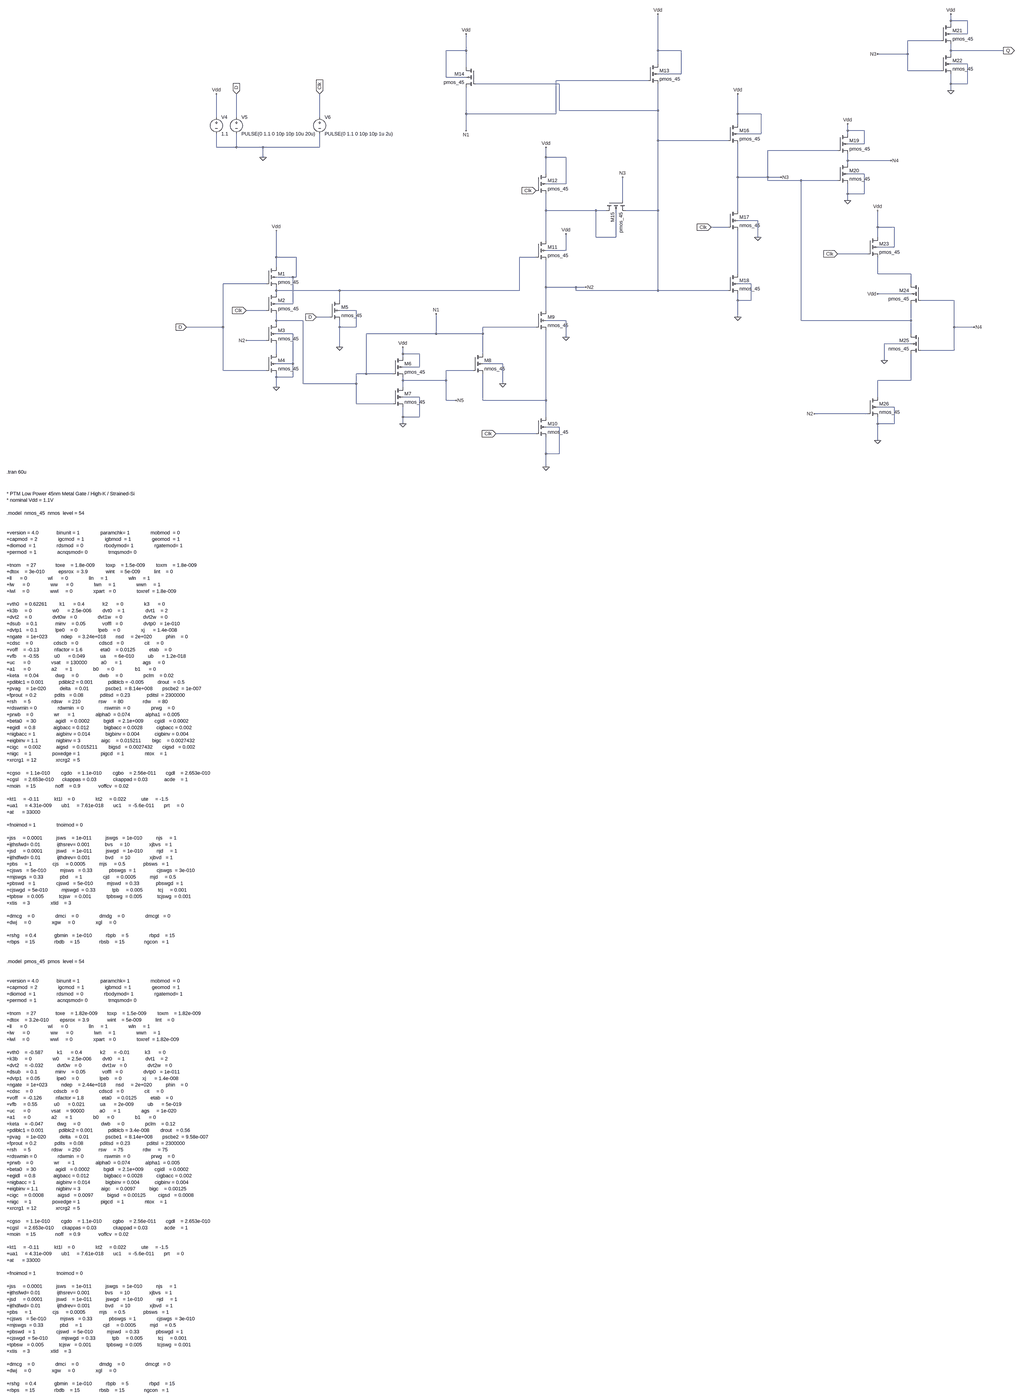
[diagram p0: schematic FinalProj-VLSI.asc, whole sheet]
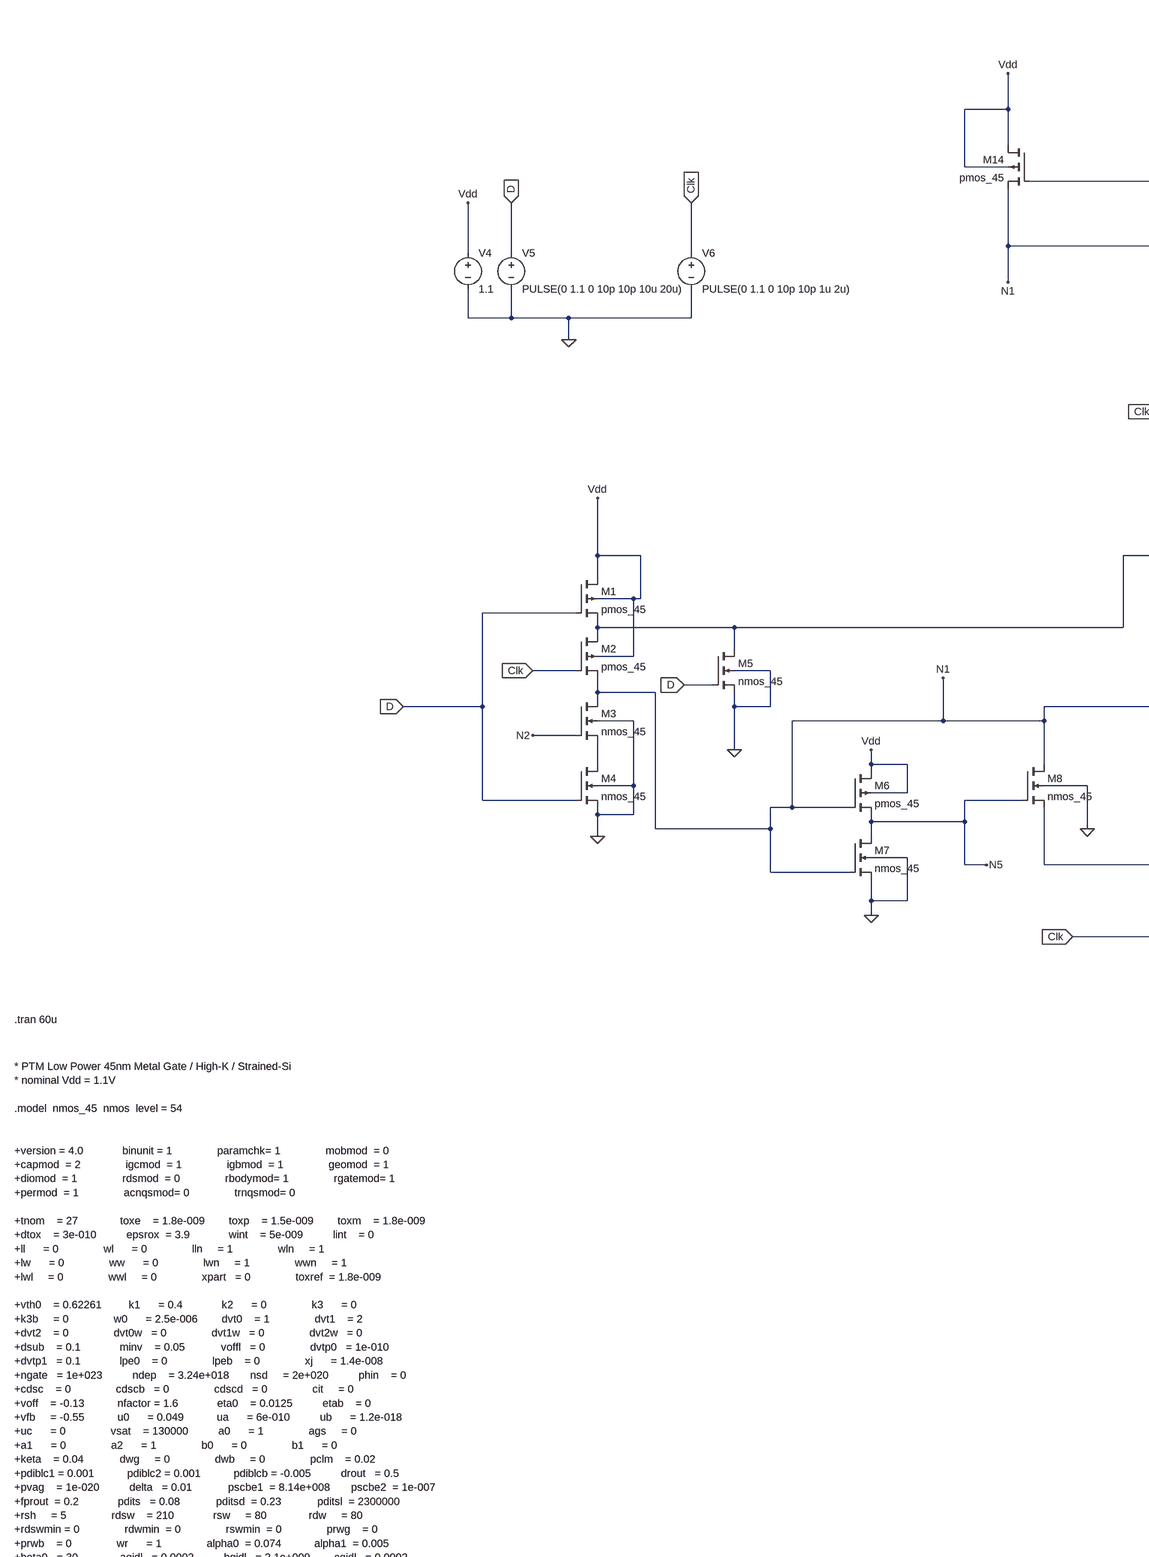
[diagram p1: schematic FinalProj-VLSI.asc, part, row 1 of 2, column 1 of 2]
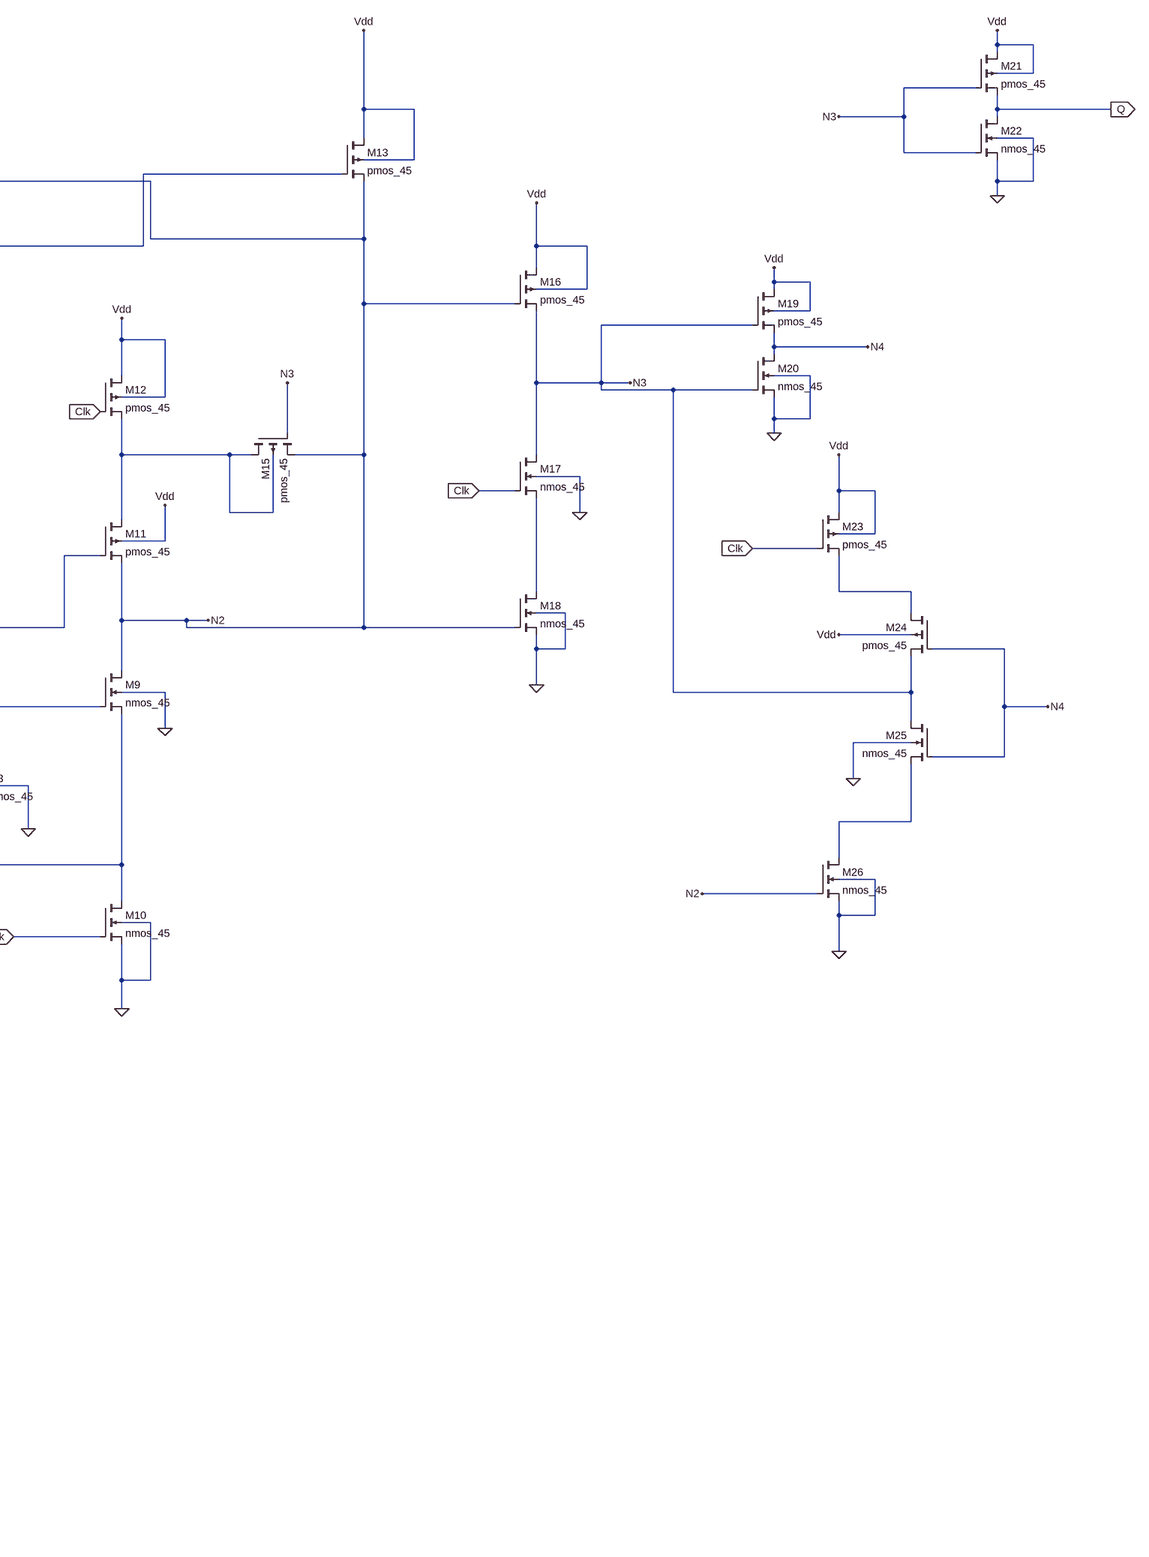
[diagram p2: schematic FinalProj-VLSI.asc, part, row 1 of 2, column 2 of 2]
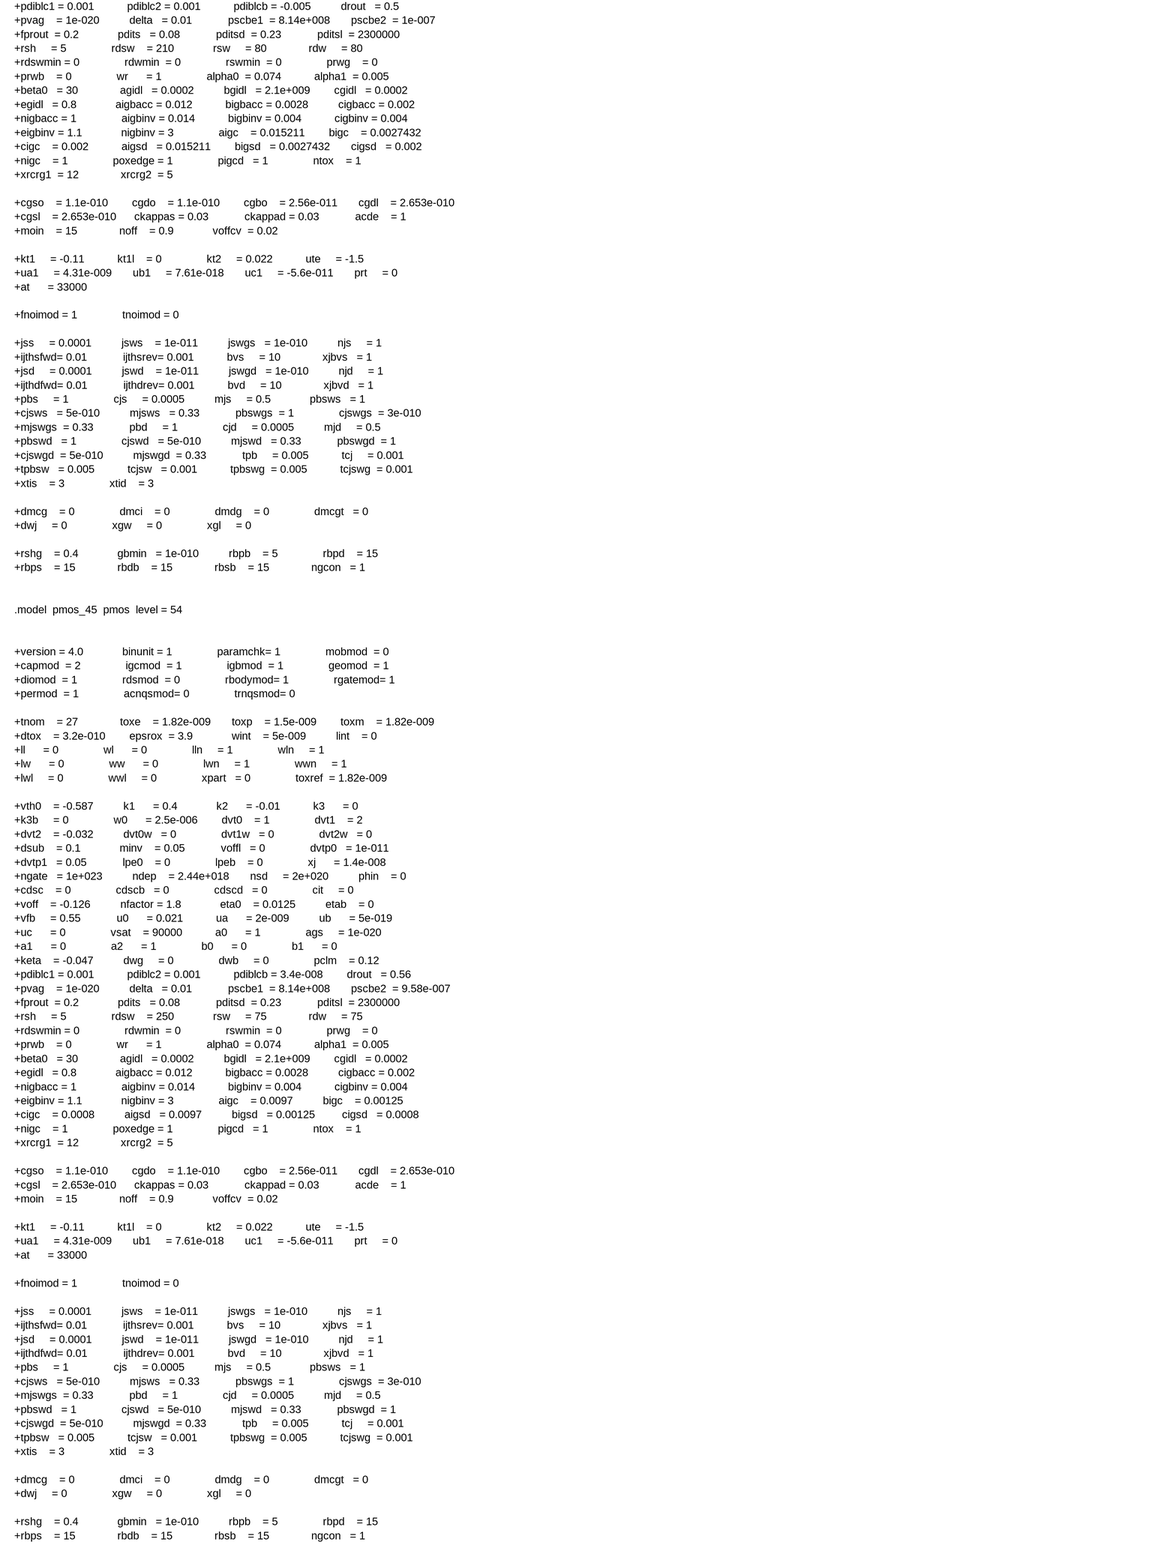
[diagram p3: schematic FinalProj-VLSI.asc, part, row 2 of 2, column 1 of 2]
FinalProj-VLSI.asc, the LTspice schematic file:
Version 4
SHEET 1 3996 5112
WIRE 3584 -1040 3584 -1072
WIRE 3664 -1040 3584 -1040
WIRE 3584 -1024 3584 -1040
WIRE 3664 -976 3664 -1040
WIRE 3664 -976 3584 -976
WIRE 3536 -944 3376 -944
WIRE 1216 -896 1216 -976
WIRE 1216 -896 1120 -896
WIRE 2176 -896 2176 -1072
WIRE 2288 -896 2176 -896
WIRE 3584 -896 3584 -928
WIRE 3920 -896 3584 -896
WIRE 3376 -880 3376 -944
WIRE 3376 -880 3232 -880
WIRE 3584 -880 3584 -896
WIRE 2176 -832 2176 -896
WIRE 3664 -832 3584 -832
WIRE 1216 -816 1216 -896
WIRE 3376 -800 3376 -880
WIRE 3536 -800 3376 -800
WIRE 2288 -784 2288 -896
WIRE 2288 -784 2176 -784
WIRE 1120 -768 1120 -896
WIRE 1216 -768 1120 -768
WIRE 2128 -752 1648 -752
WIRE 1664 -736 1264 -736
WIRE 3584 -736 3584 -784
WIRE 3664 -736 3664 -832
WIRE 3664 -736 3584 -736
WIRE 3584 -704 3584 -736
WIRE 1664 -608 1664 -736
WIRE 2176 -608 2176 -736
WIRE 2176 -608 1664 -608
WIRE 1216 -592 1216 -720
WIRE 1648 -592 1648 -752
WIRE 1648 -592 1216 -592
WIRE 2560 -592 2560 -688
WIRE 2672 -592 2560 -592
WIRE 16 -576 16 -688
WIRE 112 -576 112 -688
WIRE 512 -576 512 -688
WIRE 2560 -544 2560 -592
WIRE 1216 -512 1216 -592
WIRE 3088 -512 3088 -544
WIRE 3168 -512 3088 -512
WIRE 2672 -496 2672 -592
WIRE 2672 -496 2560 -496
WIRE 3088 -496 3088 -512
WIRE 2176 -464 2176 -608
WIRE 2512 -464 2176 -464
WIRE 3168 -448 3168 -512
WIRE 3168 -448 3088 -448
WIRE 16 -432 16 -496
WIRE 112 -432 112 -496
WIRE 112 -432 16 -432
WIRE 240 -432 112 -432
WIRE 512 -432 512 -496
WIRE 512 -432 240 -432
WIRE 3040 -416 2704 -416
WIRE 240 -384 240 -432
WIRE 1600 -384 1600 -432
WIRE 1696 -384 1600 -384
WIRE 3088 -368 3088 -400
WIRE 3296 -368 3088 -368
WIRE 3088 -352 3088 -368
WIRE 1600 -304 1600 -384
WIRE 3168 -304 3088 -304
WIRE 2560 -288 2560 -448
WIRE 2704 -288 2704 -416
WIRE 2704 -288 2560 -288
WIRE 2768 -288 2704 -288
WIRE 2704 -272 2704 -288
WIRE 2864 -272 2704 -272
WIRE 3040 -272 2864 -272
WIRE 1696 -256 1696 -384
WIRE 1696 -256 1600 -256
WIRE 3088 -208 3088 -256
WIRE 3168 -208 3168 -304
WIRE 3168 -208 3088 -208
WIRE 1968 -176 1968 -288
WIRE 3088 -176 3088 -208
WIRE 1600 -128 1600 -208
WIRE 1840 -128 1600 -128
WIRE 1888 -128 1840 -128
WIRE 2176 -128 2176 -464
WIRE 2176 -128 1984 -128
WIRE 2560 -128 2560 -288
WIRE 2656 -80 2560 -80
WIRE 2512 -48 2432 -48
WIRE 3232 -48 3232 -128
WIRE 3312 -48 3232 -48
WIRE 1840 0 1840 -128
WIRE 1936 0 1936 -128
WIRE 1936 0 1840 0
WIRE 2656 0 2656 -80
WIRE 3232 0 3232 -48
WIRE 1600 16 1600 -128
WIRE 3312 48 3312 -48
WIRE 3312 48 3232 48
WIRE 1696 64 1696 -16
WIRE 1696 64 1600 64
WIRE 3184 80 3040 80
WIRE 304 96 304 -32
WIRE 400 96 304 96
WIRE 1552 96 1472 96
WIRE 304 144 304 96
WIRE 2560 176 2560 -32
WIRE 3232 176 3232 96
WIRE 3392 176 3232 176
WIRE 384 192 304 192
WIRE 400 192 400 96
WIRE 400 192 384 192
WIRE 256 224 48 224
WIRE 2624 224 2560 224
WIRE 3392 224 3392 176
WIRE 1600 240 1600 112
WIRE 1744 240 1600 240
WIRE 1792 240 1744 240
WIRE 304 256 304 240
WIRE 608 256 304 256
WIRE 1472 256 1472 96
WIRE 1472 256 608 256
WIRE 1744 256 1744 240
WIRE 2176 256 2176 -128
WIRE 2176 256 1744 256
WIRE 2512 256 2176 256
WIRE 304 272 304 256
WIRE 3392 272 3232 272
WIRE 608 304 608 256
WIRE 2560 304 2560 272
WIRE 2624 304 2624 224
WIRE 2624 304 2560 304
WIRE 3600 304 3440 304
WIRE 384 320 384 192
WIRE 384 320 304 320
WIRE 256 352 160 352
WIRE 688 352 608 352
WIRE 1600 352 1600 240
WIRE 560 384 496 384
WIRE 2560 384 2560 304
WIRE 304 400 304 368
WIRE 432 400 304 400
WIRE 1696 400 1600 400
WIRE 2864 400 2864 -272
WIRE 3392 400 3392 320
WIRE 3392 400 2864 400
WIRE 304 416 304 400
WIRE 48 432 48 224
WIRE 48 432 -128 432
WIRE 608 432 608 400
WIRE 688 432 688 352
WIRE 688 432 608 432
WIRE 1552 432 1296 432
WIRE 3600 432 3600 304
WIRE 3696 432 3600 432
WIRE 384 464 304 464
WIRE 1072 464 1072 368
WIRE 1072 464 736 464
WIRE 1296 464 1296 432
WIRE 1296 464 1072 464
WIRE 3392 464 3392 400
WIRE 1696 480 1696 400
WIRE 256 496 160 496
WIRE 3392 512 3264 512
WIRE 608 528 608 432
WIRE 3600 544 3600 432
WIRE 3600 544 3440 544
WIRE 304 560 304 512
WIRE 912 560 912 528
WIRE 992 560 912 560
WIRE 1296 560 1296 464
WIRE 912 576 912 560
WIRE 3264 592 3264 512
WIRE 384 608 384 464
WIRE 384 608 304 608
WIRE 1392 608 1296 608
WIRE 992 624 992 560
WIRE 992 624 912 624
WIRE 48 640 48 432
WIRE 256 640 48 640
WIRE 1248 640 1120 640
WIRE 736 656 736 464
WIRE 736 656 688 656
WIRE 864 656 736 656
WIRE 304 672 304 656
WIRE 384 672 384 608
WIRE 384 672 304 672
WIRE 912 688 912 672
WIRE 1120 688 1120 640
WIRE 1120 688 912 688
WIRE 3392 688 3392 560
WIRE 3392 688 3232 688
WIRE 432 704 432 400
WIRE 688 704 688 656
WIRE 688 704 432 704
WIRE 1392 704 1392 608
WIRE 304 720 304 672
WIRE 912 720 912 688
WIRE 992 768 912 768
WIRE 3232 768 3232 688
WIRE 1120 784 1120 688
WIRE 1168 784 1120 784
WIRE 1296 784 1296 656
WIRE 1600 784 1600 448
WIRE 1600 784 1296 784
WIRE 688 800 688 704
WIRE 864 800 688 800
WIRE 3312 816 3232 816
WIRE 3184 848 2928 848
WIRE 912 864 912 816
WIRE 992 864 992 768
WIRE 992 864 912 864
WIRE 1600 864 1600 784
WIRE 912 896 912 864
WIRE 3232 896 3232 864
WIRE 3312 896 3312 816
WIRE 3312 896 3232 896
WIRE 1664 912 1600 912
WIRE 1552 944 1360 944
WIRE 3232 976 3232 896
WIRE 1600 1040 1600 960
WIRE 1664 1040 1664 912
WIRE 1664 1040 1600 1040
WIRE 1600 1104 1600 1040
FLAG -128 432 D
IOPIN -128 432 In
FLAG 496 384 D
IOPIN 496 384 In
FLAG 304 -32 Vdd
FLAG 304 720 0
FLAG 608 528 0
FLAG 160 352 Clk
IOPIN 160 352 In
FLAG 912 528 Vdd
FLAG 912 896 0
FLAG 1392 704 0
FLAG 1696 480 0
FLAG 1600 1104 0
FLAG 1360 944 Clk
IOPIN 1360 944 In
FLAG 1552 -224 Clk
IOPIN 1552 -224 In
FLAG 1600 -432 Vdd
FLAG 1072 368 N1
FLAG 1168 784 N5
FLAG 1216 -512 N1
FLAG 1216 -976 Vdd
FLAG 2176 -1072 Vdd
FLAG 1696 -16 Vdd
FLAG 160 496 N2
FLAG 1968 -288 N3
FLAG 1792 240 N2
FLAG 2560 -688 Vdd
FLAG 2656 0 0
FLAG 2560 384 0
FLAG 2432 -48 Clk
IOPIN 2432 -48 In
FLAG 2768 -288 N3
FLAG 3088 -544 Vdd
FLAG 3088 -176 0
FLAG 3584 -1072 Vdd
FLAG 3584 -704 0
FLAG 3232 -880 N3
FLAG 3296 -368 N4
FLAG 3696 432 N4
FLAG 3040 80 Clk
IOPIN 3040 80 In
FLAG 3232 272 Vdd
FLAG 3232 -128 Vdd
FLAG 3264 592 0
FLAG 3232 976 0
FLAG 2928 848 N2
FLAG 3920 -896 Q
IOPIN 3920 -896 Out
FLAG 112 -688 D
IOPIN 112 -688 In
FLAG 512 -688 Clk
IOPIN 512 -688 In
FLAG 16 -688 Vdd
FLAG 240 -384 0
SYMBOL pmos4 256 144 R0
SYMATTR InstName M1
SYMATTR Value pmos_45
SYMATTR Value2 l=45n w=180n
SYMBOL pmos4 256 272 R0
SYMATTR InstName M2
SYMATTR Value pmos_45
SYMATTR Value2 l=45n w=180n
SYMBOL nmos4 256 416 R0
SYMATTR InstName M3
SYMATTR Value nmos_45
SYMATTR Value2 l=45n w=90n
SYMBOL nmos4 256 560 R0
SYMATTR InstName M4
SYMATTR Value nmos_45
SYMATTR Value2 l=45n w=90n
SYMBOL nmos4 560 304 R0
SYMATTR InstName M5
SYMATTR Value nmos_45
SYMATTR Value2 l=45n w=90n
SYMBOL pmos4 864 576 R0
SYMATTR InstName M6
SYMATTR Value pmos_45
SYMATTR Value2 l=45n w=180n
SYMBOL nmos4 864 720 R0
SYMATTR InstName M7
SYMATTR Value nmos_45
SYMATTR Value2 l=45n w=90n
SYMBOL nmos4 1248 560 R0
SYMATTR InstName M8
SYMATTR Value nmos_45
SYMATTR Value2 l=45n w=90n
SYMBOL nmos4 1552 352 R0
SYMATTR InstName M9
SYMATTR Value nmos_45
SYMATTR Value2 l=45n w=90n
SYMBOL nmos4 1552 864 R0
SYMATTR InstName M10
SYMATTR Value nmos_45
SYMATTR Value2 l=45n w=90n
SYMBOL pmos4 1552 16 R0
SYMATTR InstName M11
SYMATTR Value pmos_45
SYMATTR Value2 l=45n w=180n
SYMBOL pmos4 1552 -304 R0
SYMATTR InstName M12
SYMATTR Value pmos_45
SYMATTR Value2 l=45n w=180n
SYMBOL pmos4 2128 -832 R0
SYMATTR InstName M13
SYMATTR Value pmos_45
SYMATTR Value2 l=45n w=180n
SYMBOL pmos4 1264 -816 M0
SYMATTR InstName M14
SYMATTR Value pmos_45
SYMATTR Value2 l=45n w=180n
SYMBOL pmos4 1888 -176 M90
SYMATTR InstName M15
SYMATTR Value pmos_45
SYMATTR Value2 l=45n w=180n
SYMBOL pmos4 2512 -544 R0
SYMATTR InstName M16
SYMATTR Value pmos_45
SYMATTR Value2 l=45n w=180n
SYMBOL nmos4 2512 -128 R0
SYMATTR InstName M17
SYMATTR Value nmos_45
SYMATTR Value2 l=45n w=90n
SYMBOL nmos4 2512 176 R0
SYMATTR InstName M18
SYMATTR Value nmos_45
SYMATTR Value2 l=45n w=90n
SYMBOL pmos4 3040 -496 R0
SYMATTR InstName M19
SYMATTR Value pmos_45
SYMATTR Value2 l=45n w=180n
SYMBOL nmos4 3040 -352 R0
SYMATTR InstName M20
SYMATTR Value nmos_45
SYMATTR Value2 l=45n w=90n
SYMBOL pmos4 3536 -1024 R0
SYMATTR InstName M21
SYMATTR Value pmos_45
SYMATTR Value2 l=45n w=180n
SYMBOL nmos4 3536 -880 R0
SYMATTR InstName M22
SYMATTR Value nmos_45
SYMATTR Value2 l=45n w=90n
SYMBOL pmos4 3184 0 R0
SYMATTR InstName M23
SYMATTR Value pmos_45
SYMATTR Value2 l=45n w=180n
SYMBOL pmos4 3440 224 M0
SYMATTR InstName M24
SYMATTR Value pmos_45
SYMATTR Value2 l=45n w=180n
SYMBOL nmos4 3440 464 M0
SYMATTR InstName M25
SYMATTR Value nmos_45
SYMATTR Value2 l=45n w=90n
SYMBOL nmos4 3184 768 R0
SYMATTR InstName M26
SYMATTR Value nmos_45
SYMATTR Value2 l=45n w=90n
SYMBOL voltage 16 -592 R0
WINDOW 123 0 0 Left 0
WINDOW 39 0 0 Left 0
SYMATTR InstName V4
SYMATTR Value 1.1
SYMBOL voltage 112 -592 R0
WINDOW 123 0 0 Left 0
WINDOW 39 0 0 Left 0
SYMATTR InstName V5
SYMATTR Value PULSE(0 1.1 0 10p 10p 10u 20u)
SYMBOL voltage 512 -592 R0
WINDOW 123 0 0 Left 0
WINDOW 39 0 0 Left 0
SYMATTR InstName V6
SYMATTR Value PULSE(0 1.1 0 10p 10p 1u 2u)
TEXT -992 1128 Left 2 !.tran 60u
TEXT -992 1232 Left 2 !* PTM Low Power 45nm Metal Gate / High-K / Strained-Si\n* nominal Vdd = 1.1V\n \n.model  nmos_45  nmos  level = 54\n \n \n+version = 4.0             binunit = 1               paramchk= 1               mobmod  = 0             \n+capmod  = 2               igcmod  = 1               igbmod  = 1               geomod  = 1             \n+diomod  = 1               rdsmod  = 0               rbodymod= 1               rgatemod= 1             \n+permod  = 1               acnqsmod= 0               trnqsmod= 0             \n \n+tnom    = 27              toxe    = 1.8e-009        toxp    = 1.5e-009        toxm    = 1.8e-009      \n+dtox    = 3e-010          epsrox  = 3.9             wint    = 5e-009          lint    = 0             \n+ll      = 0               wl      = 0               lln     = 1               wln     = 1             \n+lw      = 0               ww      = 0               lwn     = 1               wwn     = 1             \n+lwl     = 0               wwl     = 0               xpart   = 0               toxref  = 1.8e-009      \n \n+vth0    = 0.62261         k1      = 0.4             k2      = 0               k3      = 0             \n+k3b     = 0               w0      = 2.5e-006        dvt0    = 1               dvt1    = 2             \n+dvt2    = 0               dvt0w   = 0               dvt1w   = 0               dvt2w   = 0             \n+dsub    = 0.1             minv    = 0.05            voffl   = 0               dvtp0   = 1e-010        \n+dvtp1   = 0.1             lpe0    = 0               lpeb    = 0               xj      = 1.4e-008      \n+ngate   = 1e+023          ndep    = 3.24e+018       nsd     = 2e+020          phin    = 0             \n+cdsc    = 0               cdscb   = 0               cdscd   = 0               cit     = 0             \n+voff    = -0.13           nfactor = 1.6             eta0    = 0.0125          etab    = 0             \n+vfb     = -0.55           u0      = 0.049           ua      = 6e-010          ub      = 1.2e-018      \n+uc      = 0               vsat    = 130000          a0      = 1               ags     = 0             \n+a1      = 0               a2      = 1               b0      = 0               b1      = 0             \n+keta    = 0.04            dwg     = 0               dwb     = 0               pclm    = 0.02          \n+pdiblc1 = 0.001           pdiblc2 = 0.001           pdiblcb = -0.005          drout   = 0.5           \n+pvag    = 1e-020          delta   = 0.01            pscbe1  = 8.14e+008       pscbe2  = 1e-007        \n+fprout  = 0.2             pdits   = 0.08            pditsd  = 0.23            pditsl  = 2300000       \n+rsh     = 5               rdsw    = 210             rsw     = 80              rdw     = 80            \n+rdswmin = 0               rdwmin  = 0               rswmin  = 0               prwg    = 0             \n+prwb    = 0               wr      = 1               alpha0  = 0.074           alpha1  = 0.005         \n+beta0   = 30              agidl   = 0.0002          bgidl   = 2.1e+009        cgidl   = 0.0002        \n+egidl   = 0.8             aigbacc = 0.012           bigbacc = 0.0028          cigbacc = 0.002         \n+nigbacc = 1               aigbinv = 0.014           bigbinv = 0.004           cigbinv = 0.004         \n+eigbinv = 1.1             nigbinv = 3               aigc    = 0.015211        bigc    = 0.0027432     \n+cigc    = 0.002           aigsd   = 0.015211        bigsd   = 0.0027432       cigsd   = 0.002         \n+nigc    = 1               poxedge = 1               pigcd   = 1               ntox    = 1             \n+xrcrg1  = 12              xrcrg2  = 5             \n \n+cgso    = 1.1e-010        cgdo    = 1.1e-010        cgbo    = 2.56e-011       cgdl    = 2.653e-010    \n+cgsl    = 2.653e-010      ckappas = 0.03            ckappad = 0.03            acde    = 1             \n+moin    = 15              noff    = 0.9             voffcv  = 0.02          \n \n+kt1     = -0.11           kt1l    = 0               kt2     = 0.022           ute     = -1.5          \n+ua1     = 4.31e-009       ub1     = 7.61e-018       uc1     = -5.6e-011       prt     = 0             \n+at      = 33000         \n \n+fnoimod = 1               tnoimod = 0             \n \n+jss     = 0.0001          jsws    = 1e-011          jswgs   = 1e-010          njs     = 1             \n+ijthsfwd= 0.01            ijthsrev= 0.001           bvs     = 10              xjbvs   = 1             \n+jsd     = 0.0001          jswd    = 1e-011          jswgd   = 1e-010          njd     = 1             \n+ijthdfwd= 0.01            ijthdrev= 0.001           bvd     = 10              xjbvd   = 1             \n+pbs     = 1               cjs     = 0.0005          mjs     = 0.5             pbsws   = 1             \n+cjsws   = 5e-010          mjsws   = 0.33            pbswgs  = 1               cjswgs  = 3e-010        \n+mjswgs  = 0.33            pbd     = 1               cjd     = 0.0005          mjd     = 0.5           \n+pbswd   = 1               cjswd   = 5e-010          mjswd   = 0.33            pbswgd  = 1             \n+cjswgd  = 5e-010          mjswgd  = 0.33            tpb     = 0.005           tcj     = 0.001         \n+tpbsw   = 0.005           tcjsw   = 0.001           tpbswg  = 0.005           tcjswg  = 0.001         \n+xtis    = 3               xtid    = 3             \n \n+dmcg    = 0               dmci    = 0               dmdg    = 0               dmcgt   = 0             \n+dwj     = 0               xgw     = 0               xgl     = 0             \n \n+rshg    = 0.4             gbmin   = 1e-010          rbpb    = 5               rbpd    = 15            \n+rbps    = 15              rbdb    = 15              rbsb    = 15              ngcon   = 1             \n \n \n.model  pmos_45  pmos  level = 54\n \n \n+version = 4.0             binunit = 1               paramchk= 1               mobmod  = 0             \n+capmod  = 2               igcmod  = 1               igbmod  = 1               geomod  = 1             \n+diomod  = 1               rdsmod  = 0               rbodymod= 1               rgatemod= 1             \n+permod  = 1               acnqsmod= 0               trnqsmod= 0             \n \n+tnom    = 27              toxe    = 1.82e-009       toxp    = 1.5e-009        toxm    = 1.82e-009     \n+dtox    = 3.2e-010        epsrox  = 3.9             wint    = 5e-009          lint    = 0             \n+ll      = 0               wl      = 0               lln     = 1               wln     = 1             \n+lw      = 0               ww      = 0               lwn     = 1               wwn     = 1             \n+lwl     = 0               wwl     = 0               xpart   = 0               toxref  = 1.82e-009     \n \n+vth0    = -0.587          k1      = 0.4             k2      = -0.01           k3      = 0             \n+k3b     = 0               w0      = 2.5e-006        dvt0    = 1               dvt1    = 2             \n+dvt2    = -0.032          dvt0w   = 0               dvt1w   = 0               dvt2w   = 0             \n+dsub    = 0.1             minv    = 0.05            voffl   = 0               dvtp0   = 1e-011        \n+dvtp1   = 0.05            lpe0    = 0               lpeb    = 0               xj      = 1.4e-008      \n+ngate   = 1e+023          ndep    = 2.44e+018       nsd     = 2e+020          phin    = 0             \n+cdsc    = 0               cdscb   = 0               cdscd   = 0               cit     = 0             \n+voff    = -0.126          nfactor = 1.8             eta0    = 0.0125          etab    = 0             \n+vfb     = 0.55            u0      = 0.021           ua      = 2e-009          ub      = 5e-019        \n+uc      = 0               vsat    = 90000           a0      = 1               ags     = 1e-020        \n+a1      = 0               a2      = 1               b0      = 0               b1      = 0             \n+keta    = -0.047          dwg     = 0               dwb     = 0               pclm    = 0.12          \n+pdiblc1 = 0.001           pdiblc2 = 0.001           pdiblcb = 3.4e-008        drout   = 0.56          \n+pvag    = 1e-020          delta   = 0.01            pscbe1  = 8.14e+008       pscbe2  = 9.58e-007     \n+fprout  = 0.2             pdits   = 0.08            pditsd  = 0.23            pditsl  = 2300000       \n+rsh     = 5               rdsw    = 250             rsw     = 75              rdw     = 75            \n+rdswmin = 0               rdwmin  = 0               rswmin  = 0               prwg    = 0             \n+prwb    = 0               wr      = 1               alpha0  = 0.074           alpha1  = 0.005         \n+beta0   = 30              agidl   = 0.0002          bgidl   = 2.1e+009        cgidl   = 0.0002        \n+egidl   = 0.8             aigbacc = 0.012           bigbacc = 0.0028          cigbacc = 0.002         \n+nigbacc = 1               aigbinv = 0.014           bigbinv = 0.004           cigbinv = 0.004         \n+eigbinv = 1.1             nigbinv = 3               aigc    = 0.0097          bigc    = 0.00125       \n+cigc    = 0.0008          aigsd   = 0.0097          bigsd   = 0.00125         cigsd   = 0.0008        \n+nigc    = 1               poxedge = 1               pigcd   = 1               ntox    = 1             \n+xrcrg1  = 12              xrcrg2  = 5             \n \n+cgso    = 1.1e-010        cgdo    = 1.1e-010        cgbo    = 2.56e-011       cgdl    = 2.653e-010    \n+cgsl    = 2.653e-010      ckappas = 0.03            ckappad = 0.03            acde    = 1             \n+moin    = 15              noff    = 0.9             voffcv  = 0.02          \n \n+kt1     = -0.11           kt1l    = 0               kt2     = 0.022           ute     = -1.5          \n+ua1     = 4.31e-009       ub1     = 7.61e-018       uc1     = -5.6e-011       prt     = 0             \n+at      = 33000         \n \n+fnoimod = 1               tnoimod = 0             \n \n+jss     = 0.0001          jsws    = 1e-011          jswgs   = 1e-010          njs     = 1             \n+ijthsfwd= 0.01            ijthsrev= 0.001           bvs     = 10              xjbvs   = 1             \n+jsd     = 0.0001          jswd    = 1e-011          jswgd   = 1e-010          njd     = 1             \n+ijthdfwd= 0.01            ijthdrev= 0.001           bvd     = 10              xjbvd   = 1             \n+pbs     = 1               cjs     = 0.0005          mjs     = 0.5             pbsws   = 1             \n+cjsws   = 5e-010          mjsws   = 0.33            pbswgs  = 1               cjswgs  = 3e-010        \n+mjswgs  = 0.33            pbd     = 1               cjd     = 0.0005          mjd     = 0.5           \n+pbswd   = 1               cjswd   = 5e-010          mjswd   = 0.33            pbswgd  = 1             \n+cjswgd  = 5e-010          mjswgd  = 0.33            tpb     = 0.005           tcj     = 0.001         \n+tpbsw   = 0.005           tcjsw   = 0.001           tpbswg  = 0.005           tcjswg  = 0.001         \n+xtis    = 3               xtid    = 3             \n \n+dmcg    = 0               dmci    = 0               dmdg    = 0               dmcgt   = 0             \n+dwj     = 0               xgw     = 0               xgl     = 0             \n \n+rshg    = 0.4             gbmin   = 1e-010          rbpb    = 5               rbpd    = 15            \n+rbps    = 15              rbdb    = 15              rbsb    = 15              ngcon   = 1

The netlist it stands for:
* FinalProj-VLSI.asc
M1 Vdd D N002 Vdd pmos_45 l=45n w=180n
M2 N002 Clk N1 Vdd pmos_45 l=45n w=180n
M3 N1 N2 N005 0 nmos_45 l=45n w=90n
M4 N005 D 0 0 nmos_45 l=45n w=90n
M5 N002 D 0 0 nmos_45 l=45n w=90n
M6 Vdd N1 N5 Vdd pmos_45 l=45n w=180n
M7 N5 N1 0 0 nmos_45 l=45n w=90n
M8 N1 N5 N007 0 nmos_45 l=45n w=90n
M9 N2 N1 N007 0 nmos_45 l=45n w=90n
M10 N007 Clk 0 0 nmos_45 l=45n w=90n
M11 N001 N002 N2 Vdd pmos_45 l=45n w=180n
M12 Vdd Clk N001 Vdd pmos_45 l=45n w=180n
M13 Vdd N1 N2 Vdd pmos_45 l=45n w=180n
M14 Vdd N2 N1 Vdd pmos_45 l=45n w=180n
M15 N001 N3 N2 N001 pmos_45 l=45n w=180n
M16 Vdd N2 N3 Vdd pmos_45 l=45n w=180n
M17 N3 Clk N003 0 nmos_45 l=45n w=90n
M18 N003 N2 0 0 nmos_45 l=45n w=90n
M19 Vdd N3 N4 Vdd pmos_45 l=45n w=180n
M20 N4 N3 0 0 nmos_45 l=45n w=90n
M21 Vdd N3 Q Vdd pmos_45 l=45n w=180n
M22 Q N3 0 0 nmos_45 l=45n w=90n
M23 Vdd Clk N004 Vdd pmos_45 l=45n w=180n
M24 N004 N4 N3 Vdd pmos_45 l=45n w=180n
M25 N3 N4 N006 0 nmos_45 l=45n w=90n
M26 N006 N2 0 0 nmos_45 l=45n w=90n
V4 Vdd 0 1.1
V5 D 0 PULSE(0 1.1 0 10p 10p 10u 20u)
V6 Clk 0 PULSE(0 1.1 0 10p 10p 1u 2u)
.model NMOS NMOS
.model PMOS PMOS
.lib standard.mos
.tran 60u
* PTM Low Power 45nm Metal Gate / High-K / Strained-Si
* nominal Vdd = 1.1V
.model  nmos_45  nmos  level = 54
+version = 4.0             binunit = 1               paramchk= 1               mobmod  = 0
+capmod  = 2               igcmod  = 1               igbmod  = 1               geomod  = 1
+diomod  = 1               rdsmod  = 0               rbodymod= 1               rgatemod= 1
+permod  = 1               acnqsmod= 0               trnqsmod= 0
+tnom    = 27              toxe    = 1.8e-009        toxp    = 1.5e-009        toxm    = 1.8e-009
+dtox    = 3e-010          epsrox  = 3.9             wint    = 5e-009          lint    = 0
+ll      = 0               wl      = 0               lln     = 1               wln     = 1
+lw      = 0               ww      = 0               lwn     = 1               wwn     = 1
+lwl     = 0               wwl     = 0               xpart   = 0               toxref  = 1.8e-009
+vth0    = 0.62261         k1      = 0.4             k2      = 0               k3      = 0
+k3b     = 0               w0      = 2.5e-006        dvt0    = 1               dvt1    = 2
+dvt2    = 0               dvt0w   = 0               dvt1w   = 0               dvt2w   = 0
+dsub    = 0.1             minv    = 0.05            voffl   = 0               dvtp0   = 1e-010
+dvtp1   = 0.1             lpe0    = 0               lpeb    = 0               xj      = 1.4e-008
+ngate   = 1e+023          ndep    = 3.24e+018       nsd     = 2e+020          phin    = 0
+cdsc    = 0               cdscb   = 0               cdscd   = 0               cit     = 0
+voff    = -0.13           nfactor = 1.6             eta0    = 0.0125          etab    = 0
+vfb     = -0.55           u0      = 0.049           ua      = 6e-010          ub      = 1.2e-018
+uc      = 0               vsat    = 130000          a0      = 1               ags     = 0
+a1      = 0               a2      = 1               b0      = 0               b1      = 0
+keta    = 0.04            dwg     = 0               dwb     = 0               pclm    = 0.02
+pdiblc1 = 0.001           pdiblc2 = 0.001           pdiblcb = -0.005          drout   = 0.5
+pvag    = 1e-020          delta   = 0.01            pscbe1  = 8.14e+008       pscbe2  = 1e-007
+fprout  = 0.2             pdits   = 0.08            pditsd  = 0.23            pditsl  = 2300000
+rsh     = 5               rdsw    = 210             rsw     = 80              rdw     = 80
+rdswmin = 0               rdwmin  = 0               rswmin  = 0               prwg    = 0
+prwb    = 0               wr      = 1               alpha0  = 0.074           alpha1  = 0.005
+beta0   = 30              agidl   = 0.0002          bgidl   = 2.1e+009        cgidl   = 0.0002
+egidl   = 0.8             aigbacc = 0.012           bigbacc = 0.0028          cigbacc = 0.002
+nigbacc = 1               aigbinv = 0.014           bigbinv = 0.004           cigbinv = 0.004
+eigbinv = 1.1             nigbinv = 3               aigc    = 0.015211        bigc    = 0.0027432
+cigc    = 0.002           aigsd   = 0.015211        bigsd   = 0.0027432       cigsd   = 0.002
+nigc    = 1               poxedge = 1               pigcd   = 1               ntox    = 1
+xrcrg1  = 12              xrcrg2  = 5
+cgso    = 1.1e-010        cgdo    = 1.1e-010        cgbo    = 2.56e-011       cgdl    = 2.653e-010
+cgsl    = 2.653e-010      ckappas = 0.03            ckappad = 0.03            acde    = 1
+moin    = 15              noff    = 0.9             voffcv  = 0.02
+kt1     = -0.11           kt1l    = 0               kt2     = 0.022           ute     = -1.5
+ua1     = 4.31e-009       ub1     = 7.61e-018       uc1     = -5.6e-011       prt     = 0
+at      = 33000
+fnoimod = 1               tnoimod = 0
+jss     = 0.0001          jsws    = 1e-011          jswgs   = 1e-010          njs     = 1
+ijthsfwd= 0.01            ijthsrev= 0.001           bvs     = 10              xjbvs   = 1
+jsd     = 0.0001          jswd    = 1e-011          jswgd   = 1e-010          njd     = 1
+ijthdfwd= 0.01            ijthdrev= 0.001           bvd     = 10              xjbvd   = 1
+pbs     = 1               cjs     = 0.0005          mjs     = 0.5             pbsws   = 1
+cjsws   = 5e-010          mjsws   = 0.33            pbswgs  = 1               cjswgs  = 3e-010
+mjswgs  = 0.33            pbd     = 1               cjd     = 0.0005          mjd     = 0.5
+pbswd   = 1               cjswd   = 5e-010          mjswd   = 0.33            pbswgd  = 1
+cjswgd  = 5e-010          mjswgd  = 0.33            tpb     = 0.005           tcj     = 0.001
+tpbsw   = 0.005           tcjsw   = 0.001           tpbswg  = 0.005           tcjswg  = 0.001
+xtis    = 3               xtid    = 3
+dmcg    = 0               dmci    = 0               dmdg    = 0               dmcgt   = 0
+dwj     = 0               xgw     = 0               xgl     = 0
+rshg    = 0.4             gbmin   = 1e-010          rbpb    = 5               rbpd    = 15
+rbps    = 15              rbdb    = 15              rbsb    = 15              ngcon   = 1
.model  pmos_45  pmos  level = 54
+version = 4.0             binunit = 1               paramchk= 1               mobmod  = 0
+capmod  = 2               igcmod  = 1               igbmod  = 1               geomod  = 1
+diomod  = 1               rdsmod  = 0               rbodymod= 1               rgatemod= 1
+permod  = 1               acnqsmod= 0               trnqsmod= 0
+tnom    = 27              toxe    = 1.82e-009       toxp    = 1.5e-009        toxm    = 1.82e-009
+dtox    = 3.2e-010        epsrox  = 3.9             wint    = 5e-009          lint    = 0
+ll      = 0               wl      = 0               lln     = 1               wln     = 1
+lw      = 0               ww      = 0               lwn     = 1               wwn     = 1
+lwl     = 0               wwl     = 0               xpart   = 0               toxref  = 1.82e-009
+vth0    = -0.587          k1      = 0.4             k2      = -0.01           k3      = 0
+k3b     = 0               w0      = 2.5e-006        dvt0    = 1               dvt1    = 2
+dvt2    = -0.032          dvt0w   = 0               dvt1w   = 0               dvt2w   = 0
+dsub    = 0.1             minv    = 0.05            voffl   = 0               dvtp0   = 1e-011
+dvtp1   = 0.05            lpe0    = 0               lpeb    = 0               xj      = 1.4e-008
+ngate   = 1e+023          ndep    = 2.44e+018       nsd     = 2e+020          phin    = 0
+cdsc    = 0               cdscb   = 0               cdscd   = 0               cit     = 0
+voff    = -0.126          nfactor = 1.8             eta0    = 0.0125          etab    = 0
+vfb     = 0.55            u0      = 0.021           ua      = 2e-009          ub      = 5e-019
+uc      = 0               vsat    = 90000           a0      = 1               ags     = 1e-020
+a1      = 0               a2      = 1               b0      = 0               b1      = 0
+keta    = -0.047          dwg     = 0               dwb     = 0               pclm    = 0.12
+pdiblc1 = 0.001           pdiblc2 = 0.001           pdiblcb = 3.4e-008        drout   = 0.56
+pvag    = 1e-020          delta   = 0.01            pscbe1  = 8.14e+008       pscbe2  = 9.58e-007
+fprout  = 0.2             pdits   = 0.08            pditsd  = 0.23            pditsl  = 2300000
+rsh     = 5               rdsw    = 250             rsw     = 75              rdw     = 75
+rdswmin = 0               rdwmin  = 0               rswmin  = 0               prwg    = 0
+prwb    = 0               wr      = 1               alpha0  = 0.074           alpha1  = 0.005
+beta0   = 30              agidl   = 0.0002          bgidl   = 2.1e+009        cgidl   = 0.0002
+egidl   = 0.8             aigbacc = 0.012           bigbacc = 0.0028          cigbacc = 0.002
+nigbacc = 1               aigbinv = 0.014           bigbinv = 0.004           cigbinv = 0.004
+eigbinv = 1.1             nigbinv = 3               aigc    = 0.0097          bigc    = 0.00125
+cigc    = 0.0008          aigsd   = 0.0097          bigsd   = 0.00125         cigsd   = 0.0008
+nigc    = 1               poxedge = 1               pigcd   = 1               ntox    = 1
+xrcrg1  = 12              xrcrg2  = 5
+cgso    = 1.1e-010        cgdo    = 1.1e-010        cgbo    = 2.56e-011       cgdl    = 2.653e-010
+cgsl    = 2.653e-010      ckappas = 0.03            ckappad = 0.03            acde    = 1
+moin    = 15              noff    = 0.9             voffcv  = 0.02
+kt1     = -0.11           kt1l    = 0               kt2     = 0.022           ute     = -1.5
+ua1     = 4.31e-009       ub1     = 7.61e-018       uc1     = -5.6e-011       prt     = 0
+at      = 33000
+fnoimod = 1               tnoimod = 0
+jss     = 0.0001          jsws    = 1e-011          jswgs   = 1e-010          njs     = 1
+ijthsfwd= 0.01            ijthsrev= 0.001           bvs     = 10              xjbvs   = 1
+jsd     = 0.0001          jswd    = 1e-011          jswgd   = 1e-010          njd     = 1
+ijthdfwd= 0.01            ijthdrev= 0.001           bvd     = 10              xjbvd   = 1
+pbs     = 1               cjs     = 0.0005          mjs     = 0.5             pbsws   = 1
+cjsws   = 5e-010          mjsws   = 0.33            pbswgs  = 1               cjswgs  = 3e-010
+mjswgs  = 0.33            pbd     = 1               cjd     = 0.0005          mjd     = 0.5
+pbswd   = 1               cjswd   = 5e-010          mjswd   = 0.33            pbswgd  = 1
+cjswgd  = 5e-010          mjswgd  = 0.33            tpb     = 0.005           tcj     = 0.001
+tpbsw   = 0.005           tcjsw   = 0.001           tpbswg  = 0.005           tcjswg  = 0.001
+xtis    = 3               xtid    = 3
+dmcg    = 0               dmci    = 0               dmdg    = 0               dmcgt   = 0
+dwj     = 0               xgw     = 0               xgl     = 0
+rshg    = 0.4             gbmin   = 1e-010          rbpb    = 5               rbpd    = 15
+rbps    = 15              rbdb    = 15              rbsb    = 15              ngcon   = 1
.backanno
.end